# EAGLE design kicker-v2.2 (EAGLE 9.1.3)
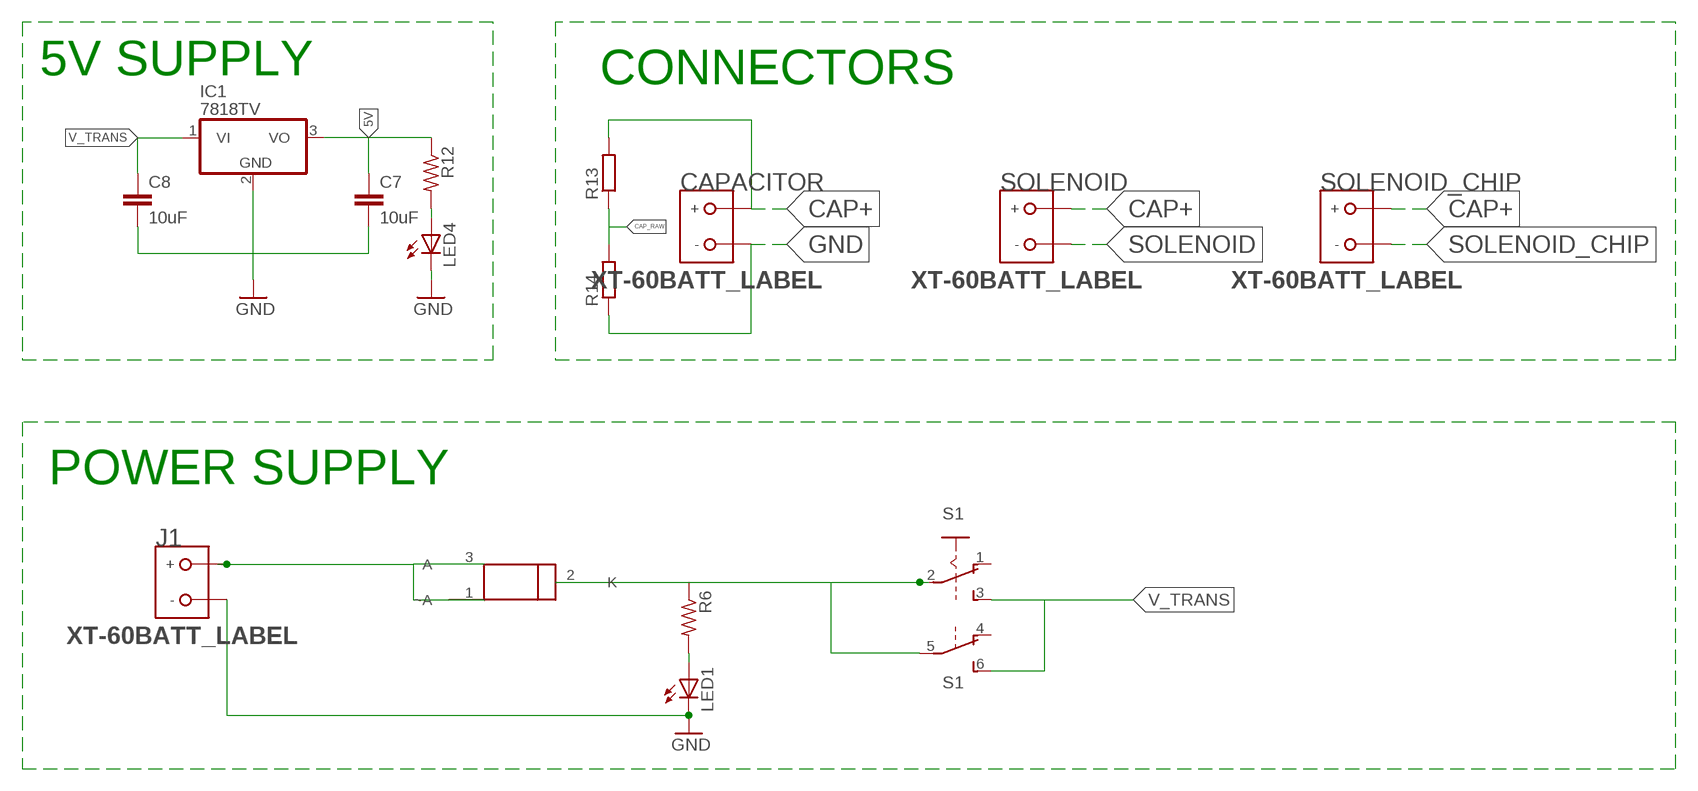
[diagram p0: schematic, sheet 1, part 1 of 2]
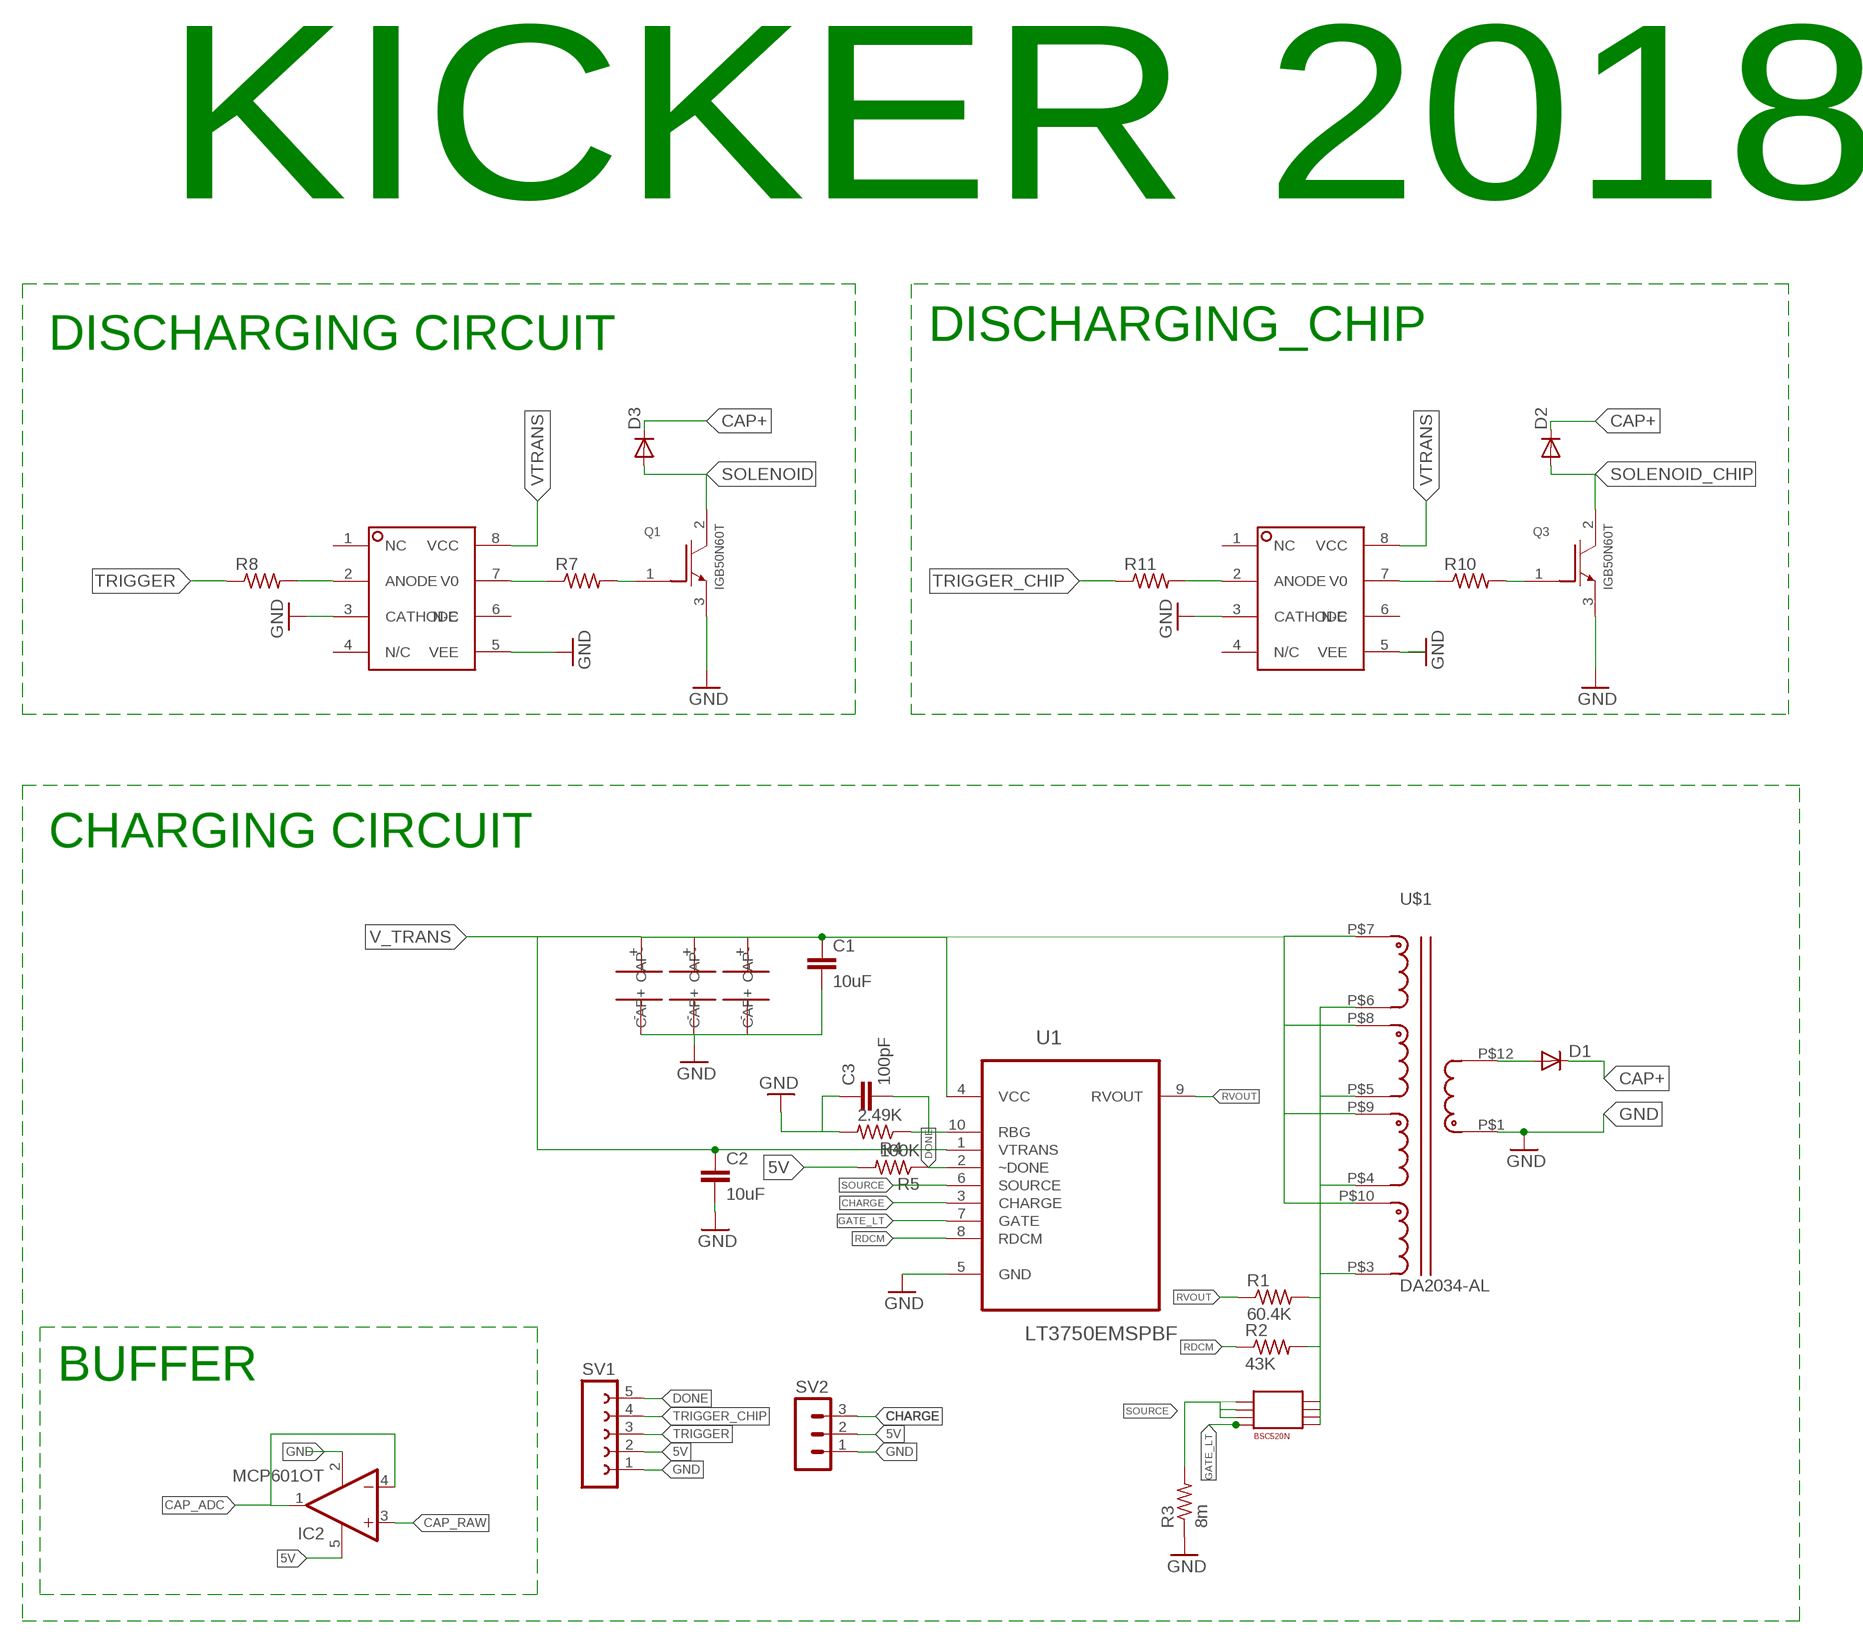
[diagram p1: schematic, sheet 1, part 2 of 2]

## Parts
C1  10uF  C-EUC1206  [C1206]
C2  10uF  C-EUC1206  [C1206]
C3  100pF  C-EUC1206  [C1206]
C7  10uF  C-EUC1206  [C1206]
C8  10uF  C-EUC1206  [C1206]
CAPACITOR  XT-60BATT_LABEL  [XT-60]
D1  DIODE-DO214AA  [DO214AA]
D2  DIODE-DO214AA  [DO214AA]
D3  DIODE-DO214AA  [DO214AA]
IC1  7818TV  [TO220V]
IC2  MCP601OT  [SOT23-5]
J1  XT-60BATT_LABEL  [XT-60]
LED1  LEDCHIPLED_1206  [CHIPLED_1206]
LED4  LEDCHIPLED_1206  [CHIPLED_1206]
Q1  IGB50N60T  [TO254P1524X457-3N-2-V]
Q3  IGB50N60T  [TO254P1524X457-3N-2-V]
R1  60.4K  R-US_M1206  [M1206]
R2  43K  R-US_M1206  [M1206]
R3  8m  R-US_M1206  [M1206]
R4  2.49K  R-US_M1206  [M1206]
R5  100K  R-US_M1206  [M1206]
R6  R-US_M1206  [M1206]
R7  R-US_M1206  [M1206]
R8  R-US_M1206  [M1206]
R10  R-US_M1206  [M1206]
R11  R-US_M1206  [M1206]
R12  R-US_M1206  [M1206]
R13  R-EU_R0805  [R0805]
R14  R-EU_R0805  [R0805]
S1  A68-A31  [A68-A31]
SOLENOID  XT-60BATT_LABEL  [XT-60]
SOLENOID_CHIP  XT-60BATT_LABEL  [XT-60]
SV1  FE05-1  [FE05-1]
SV2  MA03-1  [MA03-1]
U1  LT3750EMSPBF  [SOP50P490X110-10N]
U3  LP38690DT-3.3  [TO228P1042X238-3N]
U$1  DA2034-AL  [DA2034-AL]
U$2  56uF  CAP  [SVP_F12]
U$3  56uF  CAP  [SVP_F12]
U$4  56uF  CAP  [SVP_F12]
U$5  BSC520N  [PG-TDSON-8]
U$6  HCPL-3120-300E  [DIL08]
U$7  HCPL-3120-300E  [DIL08]

## Nets
5V: C7.1 IC1.3(VO) IC2.5(V+) R5.2 R12.1 SV1.2 SV2.2
CAP+: CAPACITOR.BATT(+) D1.C D2.C D3.C R13.2 SOLENOID.BATT(+) SOLENOID_CHIP.BATT(+)
CAP_ADC: IC2.1(OUT) IC2.4(-IN)
CAP_RAW: IC2.3(+IN) R13.1 R14.2
CHARGE: SV2.3 U1.3(CHARGE)
DONE: R5.1 SV1.5 U1.2(~DONE)
GATE_LT: U1.7(GATE) U$5.G
GND: C1.2 C2.2 C3.1 C7.2 C8.2 CAPACITOR.GND(-) IC1.2(GND) IC2.2(V-) J1.GND(-) LED1.C LED4.C Q1.3(EMITTER) Q3.3(EMITTER) R3.1 R4.2 R14.1 SV1.1 SV2.1 U1.5(GND) U$1.P$1 U$2.-(CAP-) U$3.-(CAP-) U$4.-(CAP-) U$6.3(CATHODE) U$6.5(VEE) U$7.3(CATHODE) U$7.5(VEE)
N$1: D1.A U$1.P$12
N$2: R7.1 U$6.7(V0)
N$4: C3.2 R4.1 U1.10(RBG)
N$7: R6.1 S1.2(A:P) S1.5(B:P) U3.2(K)
N$9: Q1.1(GATE) R7.2
N$10: R8.2 U$6.2(ANODE)
N$13: LED1.A R6.2
N$14: R10.1 U$7.7(V0)
N$15: Q3.1(GATE) R10.2
N$17: R11.2 U$7.2(ANODE)
N$21: LED4.A R12.2
RDCM: R2.1 U1.8(RDCM)
RVOUT: R1.1 U1.9(RVOUT)
SINK: R1.2 R2.2 U$1.P$3 U$1.P$4 U$1.P$5 U$1.P$6 U$5.D1 U$5.D2 U$5.D3 U$5.D4
SOLENOID: D3.A Q1.2(COLLECTOR) SOLENOID.GND(-)
SOLENOID_CHIP: D2.A Q3.2(COLLECTOR) SOLENOID_CHIP.GND(-)
SOURCE: R3.2 U1.6(SOURCE) U$5.S1 U$5.S2 U$5.S3
TRIGGER: R8.1 SV1.3
TRIGGER_CHIP: R11.1 SV1.4
V_TRANS: C1.1 C2.1 C8.1 IC1.1(VI) S1.3(A:S) S1.6(B:S) U1.1(VTRANS) U1.4(VCC) U$1.P$7 U$1.P$8 U$1.P$9 U$1.P$10 U$2.+(CAP+) U$3.+(CAP+) U$4.+(CAP+)
VIN: J1.BATT(+) U3.1(~A) U3.3(A)
VTRANS: U$6.8(VCC) U$7.8(VCC)
Unconnected: S1.1(A:O) S1.4(B:O) U$6.1(NC) U$6.4(N/C) U$6.6(N-C) U$7.1(NC) U$7.4(N/C) U$7.6(N-C)

## Notes on the sheet
- KICKER 2018
- DISCHARGING CIRCUIT | DISCHARGING_CHIP
- CHARGING CIRCUIT
- 5V SUPPLY | CONNECTORS
- POWER SUPPLY
- BUFFER

## Library data of the parts
C1-C3 C7 C8 = resistor:C-EU: CAPACITOR, European symbol
CAPACITOR J1 SOLENOID SOLENOID_CHIP = XT-60:XT-60: XT-60 Power Connector Distributor: HobbyKing <http://www.hobbyking.com/hobbyking/store/RC_PRODUCT_SEARCH.asp?strSearch=xt-60>
D1-D3 = diode:DIODE-: DIODE
IC1 = linear:78*: Positive VOLTAGE REGULATOR Source: http://cache.national.com/ds/LM/LM78L05.pdf http://www.fairchildsemi.com/ds/LM/LM7805.pdf
IC2 = linear:MCP601: Single Op Amp 2.7V to 6.0V Single Supply CMOS Source: http://ww1.microchip.com/downloads/en/DeviceDoc/21314g.pdf
LED1 LED4 = led:LED: LED OSRAM: - CHIPLED LG R971, LG N971, LY N971, LG Q971, LY Q971, LO R971, LY R971 LH N974, LH R974 LS Q976, LO Q976, LY Q976 LO Q996 - Hyper CHIPLED LW Q18S LB Q993, LB Q99A, LB R99A - SideLED LS A670, LO A670, LY A670, LG A670, LP A670 LB A673, LV A673, LT A673, LW A673 LH A674 LY A675 LS A676, LA A676, LO A676, LY A676, LW A676 LS A679, LY A679, LG A679 - Hyper Micro SIDELED® LS Y876, LA Y876, LO Y876, LY Y876 LT Y87S - SmartLED LW L88C, LW L88S LB L89C, LB L89S, LG L890 LS L89K, LO L89K, LY L89K LS L896, LA L896, LO L896, LY L896 - TOPLED LS T670, LO T670, LY T670, LG T670, LP T670 LSG T670, LSP T670, LSY T670, LOP T670, LYG T670 LG T671, LOG T671, LSG T671 LB T673, LV T673, LT T673, LW T673 LH T674 LS T676, LA T676, LO T676, LY T676, LB T676, LH T676, LSB T676, LW T676 LB T67C, LV T67C, LT T67C, LS T67K, LO T67K, LY T67K, LW E67C LS E67B, LA E67B, LO E67B, LY E67B, LB E67C, LV E67C, LT E67C LW T67C LS T679, LY T679, LG T679 LS T770, LO T770, LY T770, LG T770, LP T770 LB T773, LV T773, LT T773, LW T773 LH T774 LS E675, LA E675, LY E675, LS T675 LS T776, LA T776, LO T776, LY T776, LB T776 LHGB T686 LT T68C, LB T68C - Hyper Mini TOPLED® LB M676 - Mini TOPLED Santana® LG M470 LS M47K, LO M47K, LY M47K Source: http://www.osram.convergy.de LUXEON: - LUMILED® LXK2-PW12-R00, LXK2-PW12-S00, LXK2-PW14-U00, LXK2-PW14-V00 LXK2-PM12-R00, LXK2-PM12-S00, LXK2-PM14-U00 LXK2-PE12-Q00, LXK2-PE12-R00, LXK2-PE12-S00, LXK2-PE14-T00, LXK2-PE14-U00 LXK2-PB12-K00, LXK2-PB12-L00, LXK2-PB12-M00, LXK2-PB14-N00, LXK2-PB14-P00, LXK2-PB14-Q00 LXK2-PR12-L00, LXK2-PR12-M00, LXK2-PR14-Q00, LXK2-PR14-R00 LXK2-PD12-Q00, LXK2-PD12-R00, LXK2-PD12-S00 LXK2-PH12-R00, LXK2-PH12-S00 LXK2-PL12-P00, LXK2-PL12-Q00, LXK2-PL12-R00 Source: www.luxeon.com KINGBRIGHT: KA-3528ASYC Source: www.kingbright.com
Q1 Q3 = IGB50N60T:IGB50N60T: IGB50N60T Low Loss IGBT: IGBT in TRENCHSTOP and Fieldstop technology, IC 50A TO254P1524X457-3N-2-V
R1-R8 R10-R12 = resistor:R-US_: RESISTOR, American symbol
R13 R14 = resistor:R-EU_: RESISTOR, European symbol
S1 = switch:A68-A31: SLIDING SWITCH Siemens, distributor Buerklin, 11G766
SV1 = con-lsta:FE05-1: FEMALE HEADER; OC_FARNELL: unknown; OC_NEWARK: unknown
SV2 = con-lstb:MA03-1: PIN HEADER; OC_FARNELL: unknown; OC_NEWARK: unknown
U1 = LT3750-element:LT3750EMSPBF: Capacitor Charger Controller; MPN: LT3750EMS#PBF; OC_FARNELL: 1273500; OC_NEWARK: 57M8591; PACKAGE: MSOP-10; SUPPLIER: Linear Technology
U3 = LP38690DT-3.3:LP38690DT-3.3; MPN: LP38690DT-3.3; OC_FARNELL: 1008048; OC_NEWARK: 41K7439; PACKAGE: TO-252; SUPPLIER: National Semiconductor
U$1 = inductor-coilcraft-2:DA2034-AL: Flyback Transformer for Linear Technology LT3750 Reference: http://www.coilcraft.com/da2032.cfm L - 10 uH TurnsRatio Pri:Sec - 1:10 Ipeak - 10.0 A Interwinding capacitance - 128 pF DCRmax: Pri - 0.018, Sec - 1.75 Ohms
U$2-U$4 = SVP_F12:CAP
U$5 = BSC520N:BSC520N
U$6 U$7 = adafruit:HCPL-3120-300E

## Board
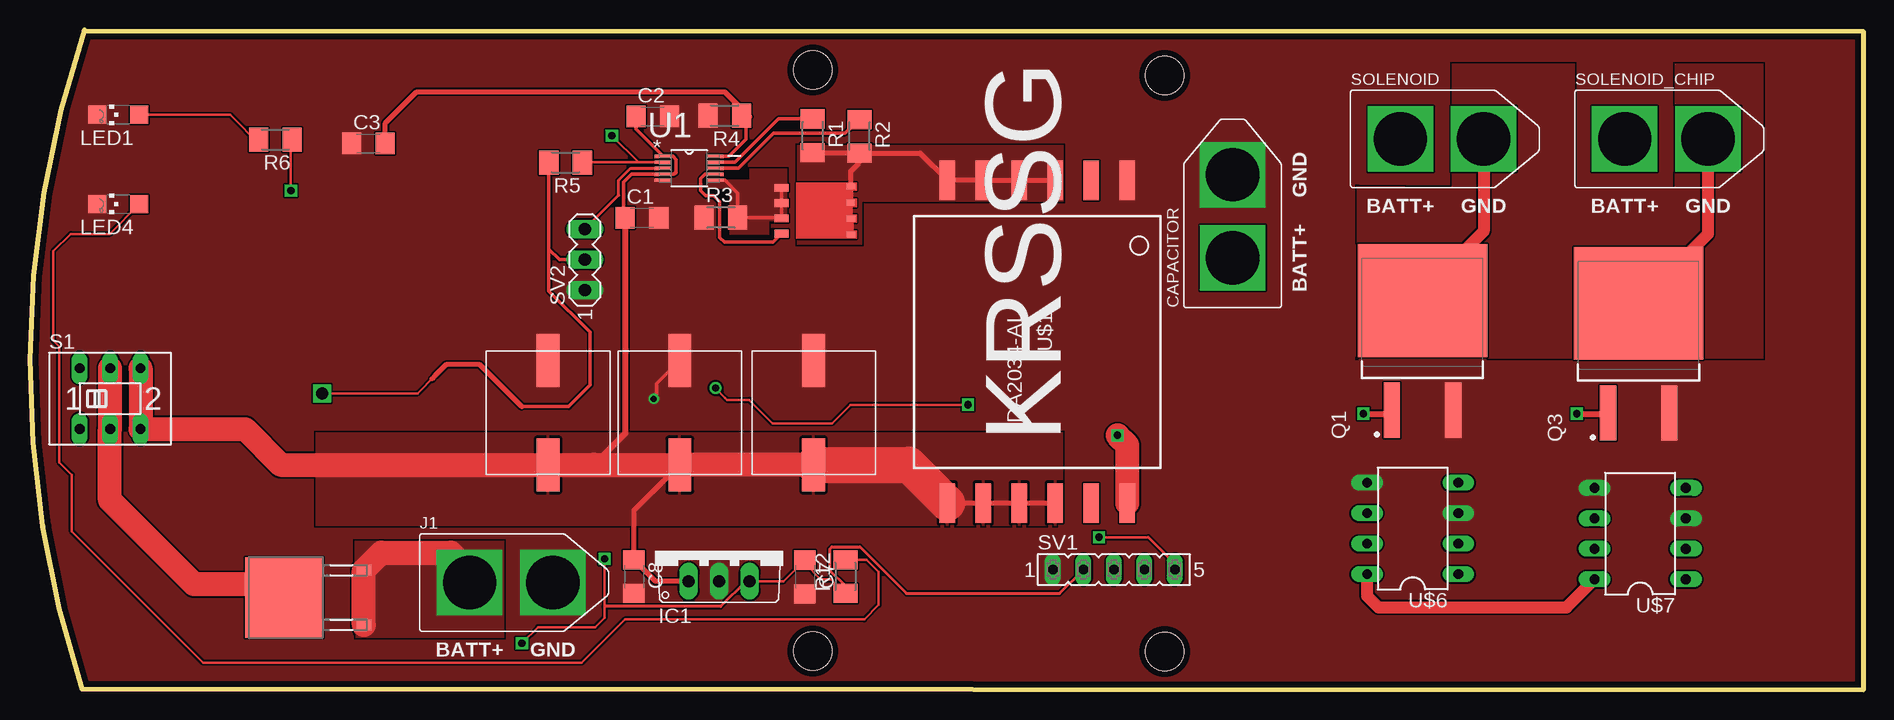
[diagram p2: board, top side]
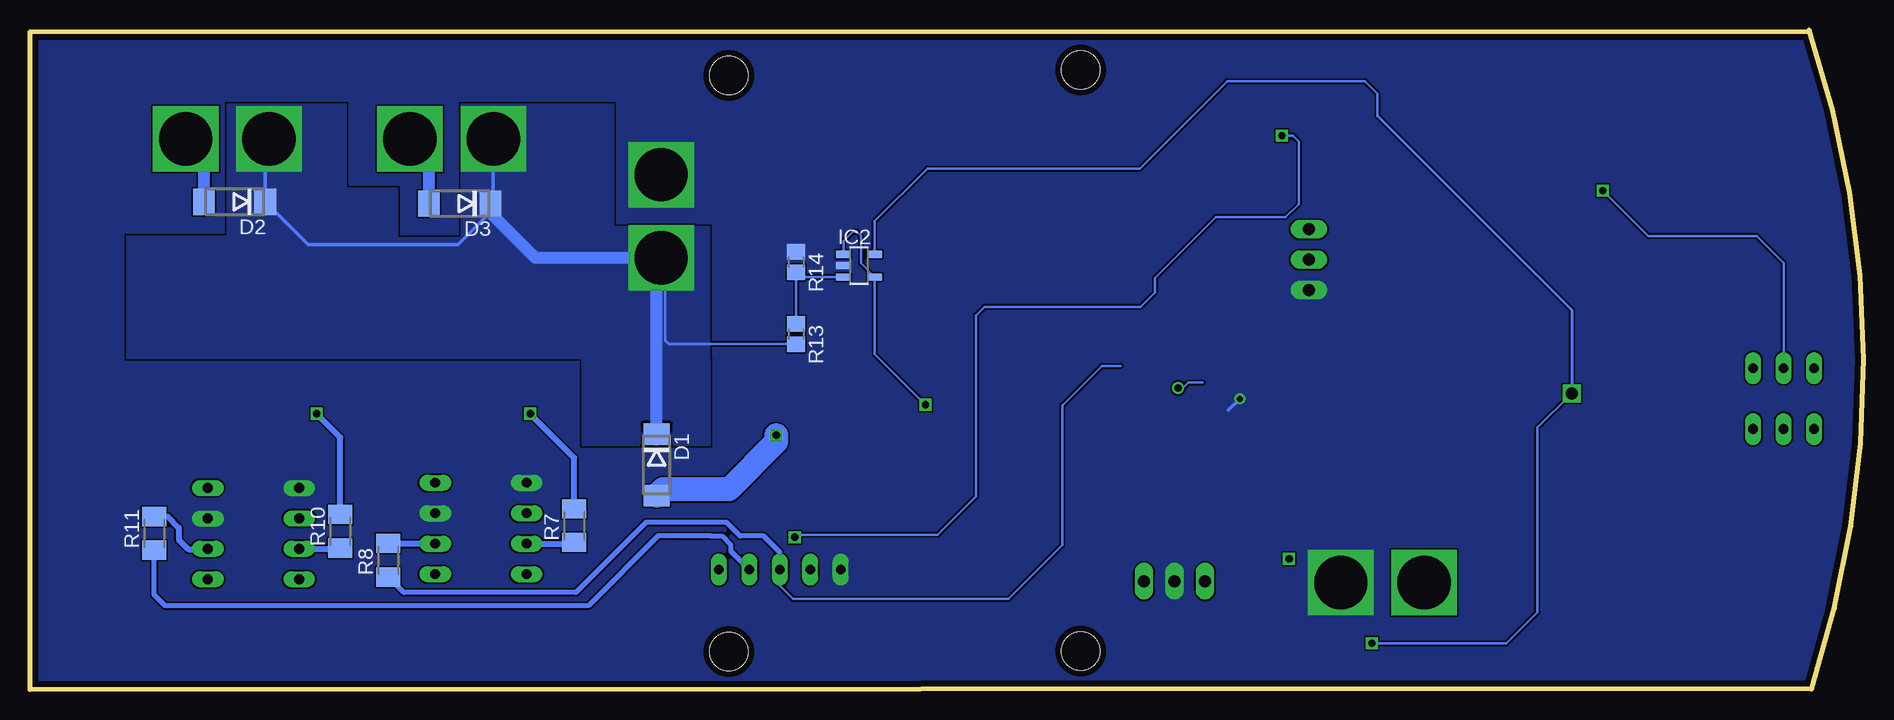
[diagram p3: board, bottom side, seen from below]

Size 152.85 x 55 mm. Coordinates in mm from the lower left corner, seen from the top.
Outline: 4.55,55 arc37 4.35,0.05 152.85,0 152.85,54.85 4.5,54.9
Copper layers (1*16): Top 0.09mm / dielectric 2.2mm / Bottom 0.09mm
Design rules "default *": minimum track width 10mil, minimum drill 0.15mm, track to track 0.15mm, track to pad 0.15mm, pad to pad 0.15mm, via to via 0.15mm, smd to smd 0.15mm, copper to edge 0.5mm, drill to drill 8mil, minimum pad ring 10mil, minimum via ring 8mil, stop-mask expansion 4mil, vias tented up to drill 0mil, thermal gap 10mil
Holes 3.2 mm at 65.25,3.2 65.25,51.65 94.6,51.2 94.6,3.15

### Footprints (pad centres in the part's own frame; a part is rotated, then mirrored left to right if it is on the bottom)
C1206 = smd 1.6 x 1.8: 1 -1.4,0; 2 1.4,0
XT-60 = drill 4.446 square: BATT 0,4.154; GND 0,11.092
DO214AA = smd 1.8 x 2.2: A 2.55,0; C -2.55,0
TO220V = drill 1.016 long: 1 -2.54,-2.54; 2 0,-2.54; 3 2.54,-2.54
SOT23-5 = smd 0.6 x 1.2: 1 -0.95,-1.306; 2 0,-1.306; 3 0.95,-1.306; 4 0.95,1.306; 5 -0.95,1.306
CHIPLED_1206 = smd 1.5 x 1.5: A 0,-1.75; C 0,1.75
TO254P1524X457-3N-2-V = smd 4.6 x 1.35: 1 -4.575,2.55; 3 -4.575,-2.55 | smd 9.4 x 10.8: 2 4.575,0
M1206 = smd 1.6 x 2: 1 -1.4,0; 2 1.4,0
R0805 = smd 1.3 x 1.5: 1 -0.85,0; 2 0.85,0
A68-A31 = drill 0.813 long: 1 -2.54,-2.54; 2 0,-2.54; 3 2.54,-2.54; 4 -2.54,2.54; 5 0,2.54; 6 2.54,2.54
FE05-1 = drill 0.813 long: 1 -5.08,0; 2 -2.54,0; 3 0,0; 4 2.54,0; 5 5.08,0
MA03-1 = drill 1.016 long: 1 -2.54,0; 2 0,0; 3 2.54,0
SOP50P490X110-10N = smd 1.397 x 0.279: 1 -2.184,0.991; 2 -2.184,0.508; 3 -2.184,0; 4 -2.184,-0.508; 5 -2.184,-0.991; 6 2.184,-0.991; 7 2.184,-0.508; 8 2.184,0; 9 2.184,0.508; 10 2.184,0.991
TO228P1042X238-3N = smd 0.889 x 1.219: 1 -2.286,-6.502; 3 2.286,-6.502 | smd 6.731 x 6.502: 2 0,0.152
DA2034-AL = smd 3.3 x 1.27: P$1 -13.46,7.5; P$2 -13.46,4.5; P$3 -13.46,1.5; P$4 -13.46,-1.5; P$5 -13.46,-4.5; P$6 -13.46,-7.5; P$7 13.46,-7.5; P$8 13.46,-4.5; P$9 13.46,-1.5; P$10 13.46,1.5; P$11 13.46,4.5; P$12 13.46,7.5
SVP_F12 = smd 1.9 x 4.4: + 5.15,-0.8; - 5.15,-9.5
PG-TDSON-8 = smd 0.5 x 0.7: D1 -0.12,5.78; D2 1.25,5.75; D3 2.58,5.81; D4 3.9,5.79 | smd 0.65 x 1.2: G 3.81,0; S1 0,0; S2 1.27,0; S3 2.54,0
DIL08 = drill 0.813 long: 1 -3.81,-3.81; 2 -1.27,-3.81; 3 1.27,-3.81; 4 3.81,-3.81; 5 3.81,3.81; 6 1.27,3.81; 7 -1.27,3.81; 8 -3.81,3.81

### Placement (x,y rotation side)
C1  51.01,39.35 0 top
C2  51.91,47.79 0 top
C3  28.21,45.54 0 top
C7  64.59,9.39 270 top
C8  50.35,9.41 270 top
CAPACITOR  100.24,31.84 0 top
D1  100.62,18.73 270 bottom
D2  135.8,40.67 180 bottom
D3  117.04,40.52 180 bottom
IC1  57.45,11.57 0 top
IC2  83.75,35.35 270 bottom
J1  32.49,8.92 270 top
LED1  7.37,47.93 90 top
LED4  7.37,40.49 90 top
Q1  116.07,27.87 90 top
Q3  134.09,27.64 90 top
R1  65.25,46.18 270 top
R2  69.15,46.13 270 top
R3  57.59,39.35 0 top
R4  57.91,47.85 180 top
R5  44.65,43.95 180 top
R6  20.46,45.87 180 top
R7  107.48,13.66 90 bottom
R8  122.98,10.78 90 bottom
R10  126.98,13.2 90 bottom
R11  142.48,13.02 90 bottom
R12  67.97,9.42 90 top
R13  89,29.65 270 bottom
R14  89,35.65 270 bottom
S1  6.68,24.26 0 top
SOLENOID  110.08,45.92 270 top
SOLENOID_CHIP  128.78,45.92 270 top
SV1  90.35,10 0 top
SV2  46.25,35.85 90 top
U1  54.95,43.47 0 top
U3  21.33,7.67 90 top
U$1  83.96,29 270 top
U$2  59.31,17.93 180 top
U$3  48.34,17.93 180 top
U$4  70.47,17.93 180 top
U$5  62.65,41.84 270 top
U$6  115.26,13.43 90 top
U$7  134.22,13 90 top

### Tracks (layer width: path | path; a pad name or v marks a point on that pad's centre or on a via)
5V  (via drill 0.6, 1)
  Top 0.2: IC1.3 62.83,9.03 C7.1 64.59,10.51 65.9,9.2 66.79,9.2 R12.1 | v47.9,10.9 47.9,6.9 47.9,6 47.1,5.2 42.35,5.2 v41,3.85 | v24.35,24.7 32.3,24.7 33.75,26.15
  Top 0.254: SV1.2 85.83,8.02 73.06,8.02 69.18,11.9 66.85,11.9 66.69,11.74 66.69,9.91 67.97,8.63 R12.1 | IC1.3 59.68,9.03 57.58,6.93 47.93,6.93 47.9,6.9
  Top 0.3: 42.83,44.37 R5.2 43.25,36.75 | 43.25,36.75 43.25,33.25 46.7,29.8 46.7,25.4 44.9,23.6 41,23.6 | SV2.2 44.15,35.85 43.25,36.75
  Top 0.4: 41,23.6 37.5,27.1 34.7,27.1 33.75,26.15 33.51,25.91
  Bottom 0.2: v41,3.85 29.8,3.85 27.2,6.45 27.2,21.85 v24.35,24.7 | IC2.5 82.44,39.06 78.05,43.45 60.35,43.45 53.05,50.75 41.6,50.75 40.55,49.7 40.55,47.85
  Bottom 0.254: 40.55,47.85 24.35,31.65 v24.35,24.7
CAP+
  Bottom 0.2: R13.2 99.6,28.8 99.9,29.1 99.9,35.65 CAPACITOR.BATT
  Bottom 0.3: SOLENOID.BATT 114.23,40.78 D3.C 114.49,39.76 117.15,37.1 129.68,37.1 D2.C 133.25,45.61 SOLENOID_CHIP.BATT
  Bottom 1: D1.C 100.62,35.62 CAPACITOR.BATT 110.72,35.99 114.49,39.76
  pour Bottom (no thermals): 96.15,27.6 96.15,38.6 104.15,38.6 104.15,48.8 116.95,48.8 116.95,37.7 122.15,37.7 122.15,41.8 126.45,41.8 126.45,48.8 136.45,48.8 136.45,37.8 144.85,37.8 144.85,27.6
  pour Bottom: 96.15,27.6 96.15,20.3 106.85,20.3 106.85,27.6
CAP_ADC  (via drill 0.6)
  Top 0.2: v78.2,23.75 68.4,23.75 66.85,22.2 61.9,22.2 59.95,24.15 58.1,24.15 57.95,24.3 v57.15,25.15
  Bottom 0.2: IC2.1 85.05,37.39 84.25,38.2 83.95,38.2 83.6,37.85 83.6,35.56 IC2.4 82.44,27.99 v78.2,23.75 | v57.15,25.15 56.75,25.15 56.3,25.6 55.11,25.6
CAP_RAW
  Bottom 0.2: R13.1 R14.2 88.6,34.4 IC2.3
CHARGE
  Top 0.254: SV2.3 49.07,41.21 49.07,42.48 50.06,43.47 U1.3
DONE  (via drill 0.6)
  Top 0.2: R5.1 46.08,43.98 U1.2 50.72,43.98 v48.5,46.2 | v89.1,12.7 93.22,12.7
  Top 0.254: 93.22,12.7 95.43,10.49 SV1.5
  Bottom 0.2: v48.5,46.2 47.6,46.2 47.1,45.7 47.1,40.5 48.2,39.4 54,39.4 59.1,34.3 59.1,33.1 60.3,31.9 73.3,31.9 74,31.2 74,16.1 77.2,12.9 88.9,12.9 v89.1,12.7
GATE_LT
  Top 0.3: U1.7 56.26,42.96 55.9,42.6 55.9,41.6 56.3,41.2 57,41.2 57.5,40.7 57.5,37.7 57.9,37.3 61.92,37.3 U$5.G
GND  (via drill 0.5)
  Top 0.3: U$2.- 52.25,25.52 52.25,24.5 v52,24.25
  Bottom 0.3: 52.95,23.3 v52,24.25
  pour Top (rank 3, no thermals): 10.45,60.35 -10.4,60.55 -10.4,-5.15 164.05,-5.1 164.05,60.6
  pour Bottom (rank 3, no thermals): -15.65,63.35 -15.65,-11.35 168.75,-10.45 168.75,64.25
N$1  (via drill 0.6)
  Top 2: U$1.P$12 91.46,20.39 v90.65,21.2
  Bottom 2: v90.65,21.2 90.65,20.65 94.6,16.7 100.1,16.7 D1.A
N$2
  Bottom 0.5: U$6.7 107.58,12.16 R7.1
N$3
  pour Top (no thermals): 118.55,41.9 118.55,52.2 128.75,52.2 128.75,41.8 137.15,41.8 137.15,52.2 144.45,52.2 144.45,27.6 110.65,27.6 110.65,42
N$4
  Top 0.3: U1.10 58.26,44.46 59.7,45.9 59.7,47.46 R4.1
  Top 0.406: 59.7,47.46 60,47.76 57.91,49.85 32.25,49.85 29.61,47.21 C3.2
N$7  (via drill 0.6)
  Top 0.2: v21.75,41.6 21.75,45.76 R6.1
  Top 2: U3.2 22.28,8.77 13.68,8.77 6.65,15.8 6.65,21.69 S1.2 S1.5
  Bottom 0.2: S1.5 6.68,35.58 8.9,37.8 17.95,37.8 v21.75,41.6
N$9  (via drill 0.6)
  Top 0.5: v111.15,23 113.22,23 Q1.1
  Bottom 0.5: R7.2 107.48,19.33 v111.15,23
N$10
  Bottom 0.5: U$6.2 122.96,12.16 R8.2
N$13
  Top 0.2: LED1.A 16.67,47.93 19.25,45.35 19.25,45.68 R6.2
N$14
  Bottom 0.5: U$7.7 127.05,11.73 R10.1
N$15  (via drill 0.6)
  Top 0.5: v128.95,23 131.47,23 Q3.1
  Bottom 0.5: R10.2 126.98,21.03 v128.95,23
N$17
  Bottom 0.5: R11.2 141.37,14.42 140.45,13.5 140.45,12.5 139.65,11.7 138.06,11.7 U$7.2
N$21
  Top 0.2: R12.2 69.73,10.82 70.75,9.8 70.75,7.05 69.55,5.85 49.6,5.85 46,2.25 14.45,2.25 3.5,13.2 3.5,17.9 2.45,18.95 2.45,28.6 1.95,29.1 1.95,36.55 3.4,38 6.63,38 LED4.A
RDCM
  Top 0.3: U1.8 59.07,43.47 62,46.4 67.92,46.4 R2.1
RVOUT
  Top 0.3: U1.9 58.78,43.98 62.4,47.6 65.23,47.6 R1.1
SINK
  Top 0.406: U$1.P$3 U$1.P$4 U$1.P$5 U$1.P$6 74.19,44.73 R2.2 | U$5.D4 68.46,37.94 U$5.D3 68.4,39.26 U$5.D2 68.43,40.59 U$5.D1 68.43,43.23 69.1,43.9 69.1,44.68 R2.2 | R2.2 65.25,44.73 R1.2
  pour Top (no thermals): 64,37.1 64,45.4 86.1,45.4 86.1,40.7 69.3,40.7 69.3,37.1
SOLENOID
  Top 1: SOLENOID.GND 121.17,38.22 116.15,33.2 116.15,32.52 Q1.2
  Bottom 1: D3.A 119.59,44.34 SOLENOID.GND
SOLENOID_CHIP
  Top 1: SOLENOID_CHIP.GND 139.87,38 Q3.2
  Bottom 1: D2.A 138.35,44.4 SOLENOID_CHIP.GND
SOURCE
  Top 0.3: U1.6 57.92,42.48 59,41.4 R3.2 62.6,39.35 U$5.S3 U$5.S2 U$5.S1
  pour Top (no thermals): 58.3,41.8 58.3,38 61.6,38 61.6,39.1 63.1,39.1 63.1,43.4 60,43.4 60,42.5 56.4,42.5 56.4,41.8
TRIGGER
  Bottom 0.2: 61.94,27 63.5,27 66.8,23.7 66.8,12.05 71.3,7.55 89.25,7.55 90.35,8.65 90.35,9.95 90.35,11.43 90.34,11.44
  Bottom 0.254: SV1.3 90.35,9.95
  Bottom 0.4: 90.34,11.44 91.7,12.8 93.7,12.8 93.7,12.85 94.8,13.95 101.5,13.95 107.35,8.1 121.7,8.1 R8.1
TRIGGER_CHIP
  Bottom 0.4: 95.18,12.8 96.1,12.8 100.5,12.8 106.3,7 141.6,7 142.5,7.9 142.5,11.6 R11.1 | 94.45,11.9 94.45,11.56 SV1.4
  Bottom 0.406: 95.18,12.8 94.45,12.07 94.45,11.9
V_TRANS
  Top 0.3: 49.5,39.46 49.5,42.3 50.16,42.96 U1.4 53.66,42.96 53.85,43.1 53.85,44.2 53.6,44.5 52.82,44.5 U1.1 50.51,46.72 C2.1
  Top 0.4: IC1.1 52.13,9.03 C8.1 50.35,14.92 U$2.+
  Top 0.406: U$1.P$10 U$1.P$9 U$1.P$8 U$1.P$7
  Top 0.5: 49.5,39.46 C1.1 49.61,21.34 47,18.73
  Top 2: U$4.+ U$2.+ 47,18.73 U$3.+ 43.17,18.75 20.9,18.75 17.93,21.72 S1.3 S1.6
  Top 3: U$4.+ 73.27,18.73 U$1.P$7
  pour Top: 23.8,21.4 23.8,13.7 86.1,13.7 86.1,21.4
VIN
  Top 2: U3.1 U3.3 29.27,11.4 35.1,11.4 36.64,9.86 J1.BATT
  pour Top (no thermals): 27.1,4.7 27.1,12.4 39.5,12.4 39.5,4.3 27.2,4.3 27.2,4.7
VTRANS
  Top 1: U$6.8 111.45,7.8 112.4,6.85 128.07,6.85 U$7.8

### Text on the board
tPlace: KRSSG